# EAGLE design bluetooth+atmega32u4 (EAGLE 7.6.0)
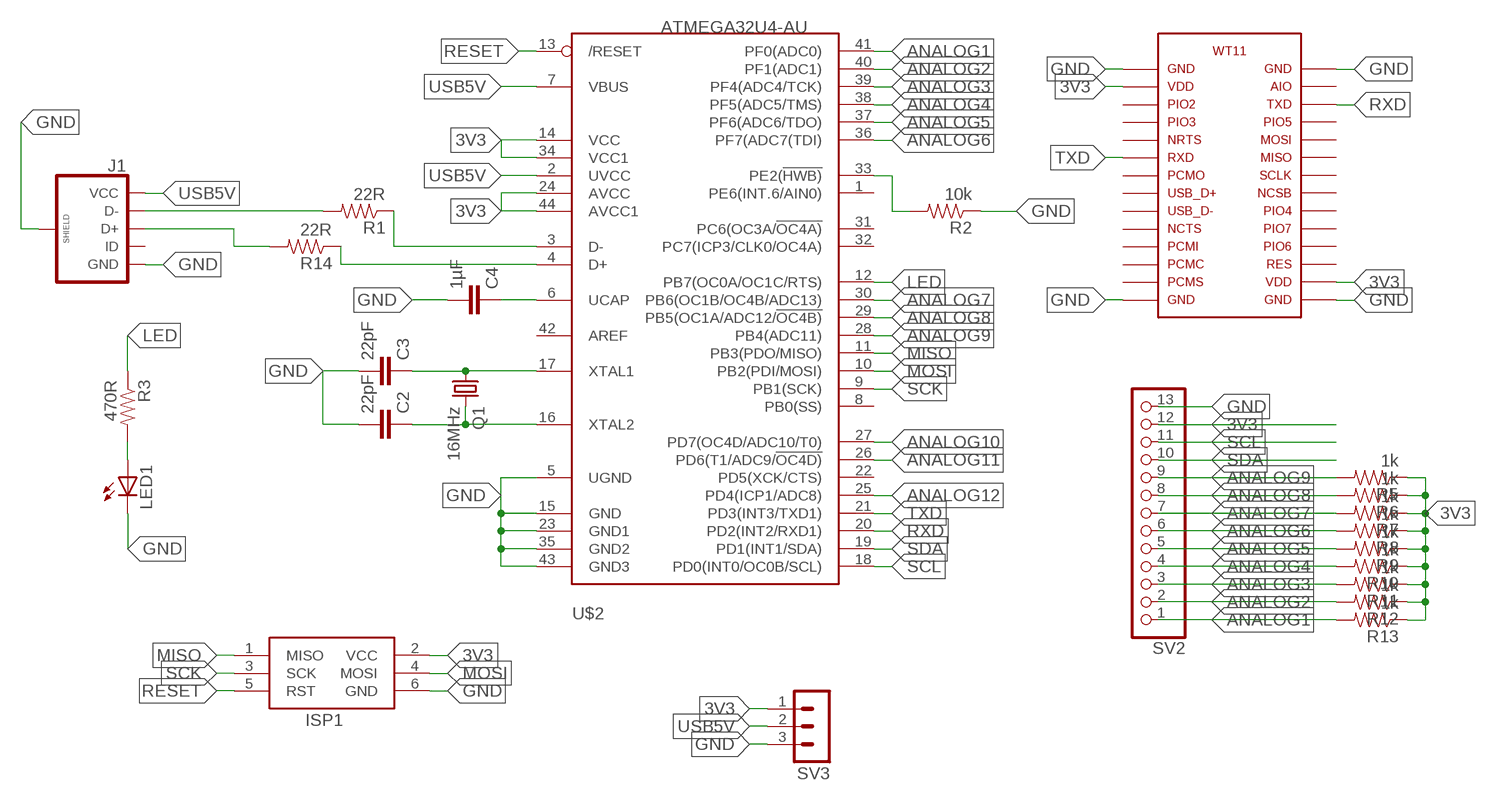
[diagram p0: schematic, sheet 1]

## Parts
C2  22pF  CAP0805  [0805]
C3  22pF  CAP0805  [0805]
C4  1µF  CAP0805  [0805]
ISP1  AVRISP-6  [AVRISP]
J1  USB_MICROB_PLUGCONN-11752  [USB-B-MICRO-SMD_V03]
LED1  LEDCHIPLED_0805  [CHIPLED_0805]
Q1  16MHz  CRYSTALCTS406  [CTS406]
R1  22R  RESISTOR0805-RES  [0805]
R2  10k  RESISTOR0805-RES  [0805]
R3  470R  RESISTOR0805-RES  [0805]
R5  1k  RESISTOR0805-RES  [0805]
R6  1k  RESISTOR0805-RES  [0805]
R7  1k  RESISTOR0805-RES  [0805]
R8  1k  RESISTOR0805-RES  [0805]
R9  1k  RESISTOR0805-RES  [0805]
R10  1k  RESISTOR0805-RES  [0805]
R11  1k  RESISTOR0805-RES  [0805]
R12  1k  RESISTOR0805-RES  [0805]
R13  1k  RESISTOR0805-RES  [0805]
R14  22R  RESISTOR0805-RES  [0805]
SV2  PINHD-1X13_WEARABLE  [1X13-WEARABLE]
SV3  MA03-1  [MA03-1]
U$2  ATMEGA32U4-AU  [TQFP44]
WT11  BLUEGIGAWT11-LONG-PADS  [BLUEGIGAWT11-LONGPADS]

## Nets
3V3: ISP1.2(VCC) R5.1 R6.1 R7.1 R8.1 R9.1 R10.1 R11.1 R12.1 R13.1 SV2.12 SV3.1 U$2.14(VCC) U$2.24(AVCC) U$2.34(VCC1) U$2.44(AVCC1) WT11.2 WT11.16
ANALOG1: R13.2 SV2.1 U$2.41(PF0(ADC0))
ANALOG2: R12.2 SV2.2 U$2.40(PF1(ADC1))
ANALOG3: R11.2 SV2.3 U$2.39(PF4(ADC4/TCK))
ANALOG4: R10.2 SV2.4 U$2.38(PF5(ADC5/TMS))
ANALOG5: R9.2 SV2.5 U$2.37(PF6(ADC6/TDO))
ANALOG6: R8.2 SV2.6 U$2.36(PF7(ADC7(TDI))
ANALOG7: R7.2 SV2.7 U$2.30(PB6(OC1B/OC4B/ADC13))
ANALOG8: R6.2 SV2.8 U$2.29(PB5(OC1A/ADC12/!OC4B))
ANALOG9: R5.2 SV2.9 U$2.28(PB4(ADC11))
ANALOG10: U$2.27(PD7(OC4D/ADC10/T0))
ANALOG11: U$2.26(PD6(T1/ADC9/!OC4D))
ANALOG12: U$2.25(PD4(ICP1/ADC8))
GND: C2.2 C3.2 C4.2 ISP1.6(GND) J1.GND J1.SHIELD1(SHIELD) J1.SHIELD2(SHIELD) J1.SHIELD3(SHIELD) LED1.C R2.1 SV2.13 SV3.3 U$2.5(UGND) U$2.15(GND) U$2.23(GND1) U$2.35(GND2) U$2.43(GND3) WT11.1 WT11.14 WT11.15 WT11.28
LED: R3.1 U$2.12(PB7(OC0A/OC1C/RTS))
MISO: ISP1.1(MISO) U$2.11(PB3(PDO/MISO))
MOSI: ISP1.4(MOSI) U$2.10(PB2(PDI/MOSI))
N$1: C3.1 Q1.1 U$2.17(XTAL1)
N$2: C2.1 Q1.3 U$2.16(XTAL2)
N$3: C4.1 U$2.6(UCAP)
N$4: R1.1 U$2.3(D-)
N$5: R14.1 U$2.4(D+)
N$6: J1.D+ R14.2
N$7: J1.D- R1.2
N$8: R2.2 U$2.33(PE2(!HWB))
N$10: LED1.A R3.2
RESET: ISP1.5(RST) U$2.13(/RESET)
RXD: U$2.20(PD2(INT2/RXD1)) WT11.26
SCK: ISP1.3(SCK) U$2.9(PB1(SCK))
SCL: SV2.11 U$2.18(PD0(INT0/OC0B/SCL))
SDA: SV2.10 U$2.19(PD1(INT1/SDA))
TXD: U$2.21(PD3(INT3/TXD1)) WT11.6
USB5V: J1.VBUS(VCC) SV3.2 U$2.2(UVCC) U$2.7(VBUS)
Unconnected: J1.ID U$2.1(PE6(INT.6/AIN0)) U$2.8(PB0(SS)) U$2.22(PD5(XCK/CTS)) U$2.31(PC6(OC3A/!OC4A)) U$2.32(PC7(ICP3/CLK0/OC4A)) U$2.42(AREF) WT11.3 WT11.4 WT11.5 WT11.7 WT11.8 WT11.9 WT11.10 WT11.11 WT11.12 WT11.13 WT11.17 WT11.18 WT11.19 WT11.20 WT11.21 WT11.22 WT11.23 WT11.24 WT11.25 WT11.27

## Library data of the parts
C2-C4 = SparkFun-Capacitors:CAP: Capacitor Standard 0603 ceramic capacitor, and 0.1" leaded capacitor.
ISP1 = adafruit:AVRISP: AVR ISP HEADER Standard 6 pin header for AVR programming
J1 = SparkFun-Connectors:USB_MICROB_PLUG: USB Micro-B connectors Some male, some female. Watch your step!; PROD_ID: CONN-11752
LED1 = adafruit:LED: LED OSRAM: - CHIPLED LG R971, LG N971, LY N971, LG Q971, LY Q971, LO R971, LY R971 LH N974, LH R974 LS Q976, LO Q976, LY Q976 LO Q996 - Hyper CHIPLED LW Q18S LB Q993, LB Q99A, LB R99A - SideLED LS A670, LO A670, LY A670, LG A670, LP A670 LB A673, LV A673, LT A673, LW A673 LH A674 LY A675 LS A676, LA A676, LO A676, LY A676, LW A676 LS A679, LY A679, LG A679 - Hyper Micro SIDELED® LS Y876, LA Y876, LO Y876, LY Y876 LT Y87S - SmartLED LW L88C, LW L88S LB L89C, LB L89S, LG L890 LS L89K, LO L89K, LY L89K LS L896, LA L896, LO L896, LY L896 - TOPLED LS T670, LO T670, LY T670, LG T670, LP T670 LSG T670, LSP T670, LSY T670, LOP T670, LYG T670 LG T671, LOG T671, LSG T671 LB T673, LV T673, LT T673, LW T673 LH T674 LS T676, LA T676, LO T676, LY T676, LB T676, LH T676, LSB T676, LW T676 LB T67C, LV T67C, LT T67C, LS T67K, LO T67K, LY T67K, LW E67C LS E67B, LA E67B, LO E67B, LY E67B, LB E67C, LV E67C, LT E67C LW T67C LS T679, LY T679, LG T679 LS T770, LO T770, LY T770, LG T770, LP T770 LB T773, LV T773, LT T773, LW T773 LH T774 LS E675, LA E675, LY E675, LS T675 LS T776, LA T776, LO T776, LY T776, LB T776 LHGB T686 LT T68C, LB T68C - Hyper Mini TOPLED® LB M676 - Mini TOPLED Santana® LG M470 LS M47K, LO M47K, LY M47K Source: http://www.osram.convergy.de/
Q1 = adafruit:CRYSTAL: CRYSTAL; OC_FARNELL: unknown; OC_NEWARK: unknown
R1-R3 R5-R14 = SparkFun-Resistors:RESISTOR: Resistor Basic schematic elements and footprints for 0603, 1206, and PTH resistors.
SV2 = futuwear:PINHD-1X13: PIN HEADER
SV3 = con-lstb:MA03-1: PIN HEADER; OC_FARNELL: unknown; OC_NEWARK: unknown
U$2 = adafruit:ATMEGA32U4: http://www.ladyada.net/library/eagle
WT11 = Bluegiga:BLUEGIGAWT11

## Board
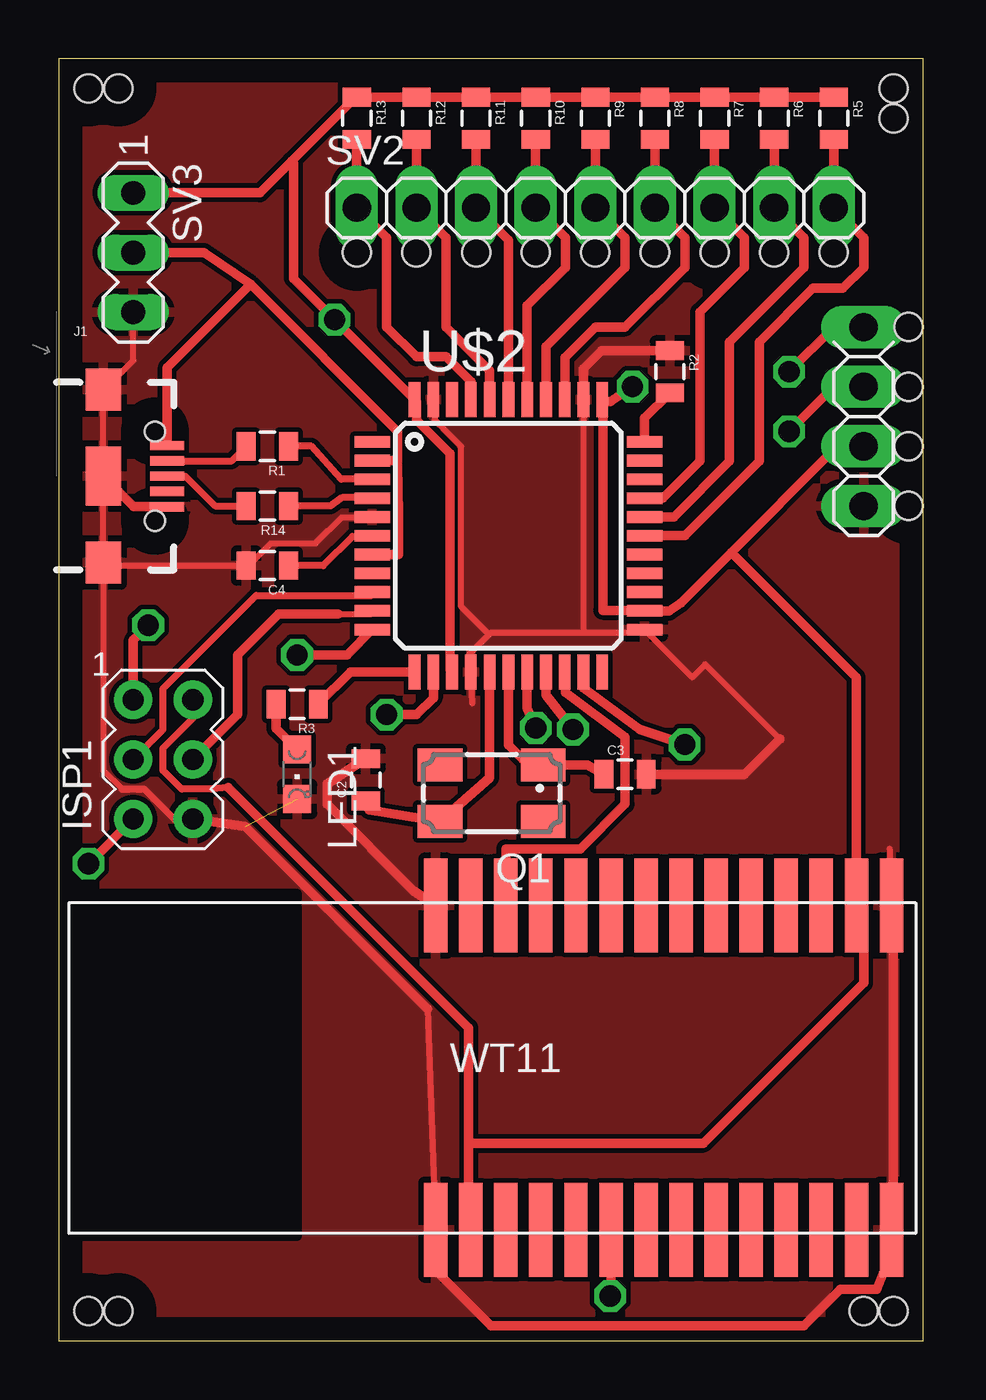
[diagram p1: board, top side]
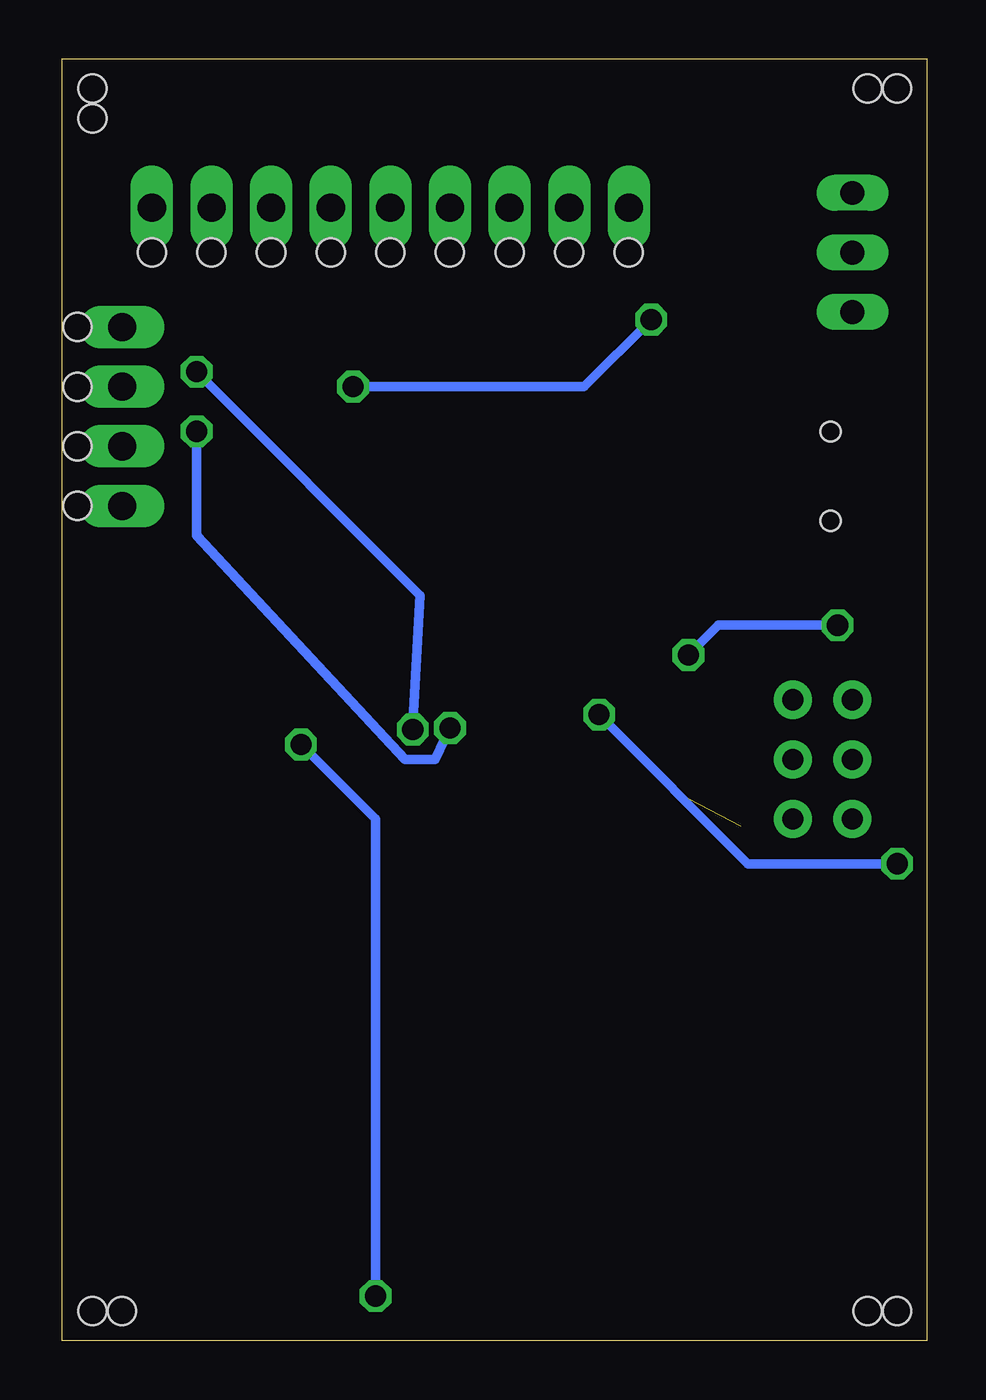
[diagram p2: board, bottom side, seen from below]

Size 36.83 x 54.61 mm. Coordinates in mm from the lower left corner, seen from the top.
Outline: 0,0 36.83,0 36.83,54.61 0,54.61 0,0
Copper layers (1*16): Top 0.035mm / dielectric 1.5mm / Bottom 0.035mm
Design rules "default *": minimum track width 10mil, minimum drill 24mil, track to track 8mil, track to pad 16mil, pad to pad 8mil, via to via 8mil, smd to smd 8mil, copper to edge 40mil, drill to drill 8mil, minimum pad ring 10mil, minimum via ring 8mil, stop-mask expansion 4mil, vias tented up to drill 0mil, thermal gap 10mil
Holes 1.2 mm at 12.7,46.35 15.24,46.35 17.78,46.35 20.32,46.35 22.86,46.35 25.4,46.35 27.94,46.35 30.48,46.35 33.02,46.35 35.56,53.34 35.56,52.07 1.27,53.34 2.54,53.34 1.27,1.27 2.54,1.27 35.56,1.27 34.29,1.27 36.2,43.18 36.2,40.64 36.2,38.1 36.2,35.56
tRestrict: area 1.3,4.4 to 10.2,19

### Footprints (pad centres in the part's own frame; a part is rotated, then mirrored left to right if it is on the bottom)
0805 = smd 0.8 x 1.2: 1 -0.9,0; 2 0.9,0
AVRISP = drill 0.9 pad 1.626: 1 -1.27,2.54; 2 1.27,2.54; 3 -1.27,0; 4 1.27,0; 5 -1.27,-2.54; 6 1.27,-2.54
USB-B-MICRO-SMD_V03 = smd 1.45 x 0.4: D+ 2.725,0; D- 2.725,0.65; GND 2.725,-1.3; ID 2.725,-0.65; VBUS 2.725,1.3 | smd 1.5 x 1.8: SHIELD1 0,3.685; SHIELD2 0,-3.685 | smd 1.5 x 2.5: SHIELD3 0,0 | hole 0.85: 2.2,1.9; 2.2,-1.9
CHIPLED_0805 = smd 1.2 x 1.2: A 0,-1.05; C 0,1.05
CTS406 = smd 1.9 x 1.4: 1 -2.2,-1.2; 2 2.2,-1.2; 3 2.2,1.2; 4 -2.2,1.2
1X13-WEARABLE = drill 1.2 pad 1.676 long: 1 -15.24,0; 2 -12.7,0; 3 -10.16,0; 4 -7.62,0; 5 -5.08,0; 6 -2.54,0; 7 0,0; 8 2.54,0; 9 5.08,0; 10 6.35,-5.08; 11 6.35,-7.62; 12 6.35,-10.16; 13 6.35,-12.7
MA03-1 = drill 1.016 long: 1 -2.54,0; 2 0,0; 3 2.54,0
TQFP44 = smd 1.5 x 0.5: 1 -5.8,4; 2 -5.8,3.2; 3 -5.8,2.4; 4 -5.8,1.6; 5 -5.8,0.8; 6 -5.8,0; 7 -5.8,-0.8; 8 -5.8,-1.6; 9 -5.8,-2.4; 10 -5.8,-3.2; 11 -5.8,-4; 23 5.8,-4; 24 5.8,-3.2; 25 5.8,-2.4; 26 5.8,-1.6; 27 5.8,-0.8; 28 5.8,0; 29 5.8,0.8; 30 5.8,1.6; 31 5.8,2.4; 32 5.8,3.2; 33 5.8,4 | smd 0.5 x 1.5: 12 -4,-5.8; 13 -3.2,-5.8; 14 -2.4,-5.8; 15 -1.6,-5.8; 16 -0.8,-5.8; 17 0,-5.8; 18 0.8,-5.8; 19 1.6,-5.8; 20 2.4,-5.8; 21 3.2,-5.8; 22 4,-5.8; 34 4,5.8; 35 3.2,5.8; 36 2.4,5.8; 37 1.6,5.8; 38 0.8,5.8; 39 0,5.8; 40 -0.8,5.8; 41 -1.6,5.8; 42 -2.4,5.8; 43 -3.2,5.8; 44 -4,5.8
BLUEGIGAWT11-LONGPADS = smd 1 x 4: 1 2.986,7.328; 2 1.493,7.328; 3 0,7.328; 4 -1.493,7.328; 5 -2.986,7.328; 6 -4.479,7.328; 7 -5.972,7.328; 8 -7.465,7.328; 9 -8.958,7.328; 10 -10.451,7.328; 11 -11.944,7.328; 12 -13.437,7.328; 13 -14.93,7.328; 14 -16.423,7.328; 15 -16.423,-6.472; 16 -14.93,-6.472; 17 -13.437,-6.472; 18 -11.944,-6.472; 19 -10.451,-6.472; 20 -8.958,-6.472; 21 -7.465,-6.472; 22 -5.972,-6.472; 23 -4.479,-6.472; 24 -2.986,-6.472; 25 -1.493,-6.472; 26 0,-6.472; 27 1.493,-6.472; 28 2.986,-6.472

### Placement (x,y rotation side)
C2  13.08,23.89 90 top
C3  24.13,24.13 0 top
C4  8.89,33.02 180 top
ISP1  4.45,24.77 0 top
J1  1.91,36.83 0 top
LED1  10.16,24.13 180 top
Q1  18.45,23.33 180 top
R1  8.89,38.1 180 top
R2  26.04,41.27 270 top
R3  10.16,27.11 180 top
R5  33.02,52.07 270 top
R6  30.48,52.07 270 top
R7  27.94,52.07 270 top
R8  25.4,52.07 270 top
R9  22.86,52.07 270 top
R10  20.32,52.07 270 top
R11  17.78,52.07 270 top
R12  15.24,52.07 270 top
R13  12.7,52.07 270 top
R14  8.89,35.56 180 top
SV2  27.94,48.26 0 top
SV3  3.18,46.35 270 top
U$2  19.16,34.29 0 top
WT11  19.05,12.06 180 top

### Tracks (layer width: path | path; a pad name or v marks a point on that pad's centre or on a via)
3V3  (via drill 0.9)
  Top 0.254: 12.54,52.86 R13.1 | 16.67,28.57 U$2.14 | 15.24,40 U$2.44 15.08,40.16 | 17.46,5.4 WT11.2 | 33.97,19.05 WT11.16 | 10,50.16 9.92,50.24 | 24.13,31.12 24.92,31.12 U$2.24 25.08,31.08 25.62,31.08 | 23.18,40 U$2.34
  Top 0.305: ISP1.2 5.71,26.51 4.45,25.24 4.45,24.29 5.24,23.49 6.51,23.49 7.22,23.57
  Top 0.406: R13.1 R12.1 R11.1 R10.1 R9.1 R8.1 R7.1 R6.1 R5.1 | SV3.1 8.57,48.89 9.92,50.24 12.54,52.86 | 16.67,28.57 16.67,37.78 15.24,39.21 15.24,40 | 17.46,8.41 17.46,13.33 7.22,23.57 | 10,50.16 10,45.24 v11.75,43.5 15.08,40.16 | 24.13,31.12 23.18,31.12 23.18,40 23.49,40 v24.45,40.64 | SV2.12 32.86,37.78 28.65,33.58 | 28.65,33.58 26.51,31.43 26,31.08 25.62,31.08 | 33.97,19.05 33.97,28.26 28.65,33.58 | 17.46,8.41 27.46,8.41 34.29,15.24 34.29,18.23 WT11.16 | 17.46,8.41 17.46,4.83 WT11.2
  Bottom 0.406: v24.45,40.64 14.61,40.64 v11.75,43.5
ANALOG1
  Top 0.406: R13.2 SV2.1 13.97,46.99 13.97,43.18 15.24,41.91 16.51,41.91 17.56,40.86 U$2.41
ANALOG2
  Top 0.406: R12.2 SV2.2 16.51,46.99 16.51,43.18 18.36,41.33 U$2.40
ANALOG3
  Top 0.406: R11.2 SV2.3 19.16,46.88 U$2.39
ANALOG4
  Top 0.406: R10.2 SV2.4 21.59,46.99 21.59,45.72 19.96,44.09 U$2.38
ANALOG5
  Top 0.406: R9.2 SV2.5 24.13,46.99 24.13,45.72 20.76,42.35 U$2.37
ANALOG6
  Top 0.406: R8.2 SV2.6 26.67,46.99 26.67,45.72 24.13,43.18 22.86,43.18 21.56,41.88 U$2.36
ANALOG7
  Top 0.406: R7.2 SV2.7 29.21,46.99 29.21,45.72 27.3,43.81 27.3,37.46 25.73,35.89 U$2.30
ANALOG8
  Top 0.406: R6.2 SV2.8 31.75,46.99 31.75,45.72 28.58,42.55 28.58,37.46 26.2,35.09 U$2.29
ANALOG9
  Top 0.406: R5.2 SV2.9 34.29,46.99 34.29,45.72 33.4,44.83 32.13,44.83 29.84,42.55 29.84,37.46 26.67,34.29 U$2.28
GND  (1 unrouted)
  Top 0.254: 1.91,40.48 J1.SHIELD3 J1.SHIELD2 1.91,33.02 | SV3.3 3.18,41.75 1.91,40.48 | 1.91,40.48 J1.SHIELD1 | 1.91,33.02 C4.2 8.1,33.02 9.05,33.97 10.95,33.97 12.06,35.08 13.34,35.08 U$2.5 | 4.92,22.23 ISP1.6 | 2.7,23.49 1.91,24.29 1.91,33.02 | 15.72,14.13 16.03,5.4 WT11.1 16.19,5.24 16.19,3.65 | 35.56,5.4 WT11.14 35.56,5.24 35.56,3.97 | 35.56,19.05 WT11.15 35.4,19.21 35.4,20.95 | 17.62,27.15 U$2.15 17.46,28.57 17.46,29.21 18.34,30.08 | 12.86,24.92 C2.2 | 22.38,30.16 18.41,30.16 18.34,30.08 | 22.38,30.16 24.92,30.16 U$2.23 25.08,30.16 26.99,28.26 27.54,28.81 30.72,25.64 | 18.34,30.08 17.15,31.27 17.15,38.1 16.03,39.21 16.03,40 U$2.43 | 22.38,30.16 22.38,40 U$2.35
  Top 0.305: 4.92,22.23 3.65,23.49 2.7,23.49
  Top 0.406: 35.56,19.05 35.56,5.4 | 35.56,3.97 34.86,2.19 33.31,2.19 31.75,0.64 18.41,0.64 16.19,2.86 16.19,3.65 | J1.GND 3.21,35.53 J1.SHIELD3 | WT11.28 15.12,19.17 11.43,22.86 11.43,23.72 C2.2 | C3.2 29.21,24.13 30.72,25.64 | R2.1 23.12,42.17 22.36,41.41 U$2.35 | ISP1.6 7.94,21.91 15.72,14.13
  pour Top: 0,54.61 36.83,54.61 36.83,0 0,0
LED
  Top 0.406: U$2.12 12.44,28.49 R3.1
MISO  (via drill 0.9)
  Top 0.406: ISP1.1 3.18,29.84 v3.81,30.48 | v10.16,29.21 12.28,29.21 U$2.11
  Bottom 0.406: v3.81,30.48 8.89,30.48 v10.16,29.21
MOSI
  Top 0.254: 11.91,30.96 13.34,30.96 U$2.10
  Top 0.406: 11.91,30.96 9.37,30.96 7.62,29.21 7.62,26.67 ISP1.4
N$1
  Top 0.406: C3.1 22.53,24.53 Q1.1 19.77,24.77 19.16,25.38 19.16,27.92 U$2.17
N$2
  Top 0.406: U$2.16 18.36,23.98 Q1.3 13.22,22.61 C2.1
N$3
  Top 0.254: 12.51,34.26 12.99,34.26 13.34,34.29 U$2.6
  Top 0.305: C4.1 11.27,33.02 12.51,34.26
N$4
  Top 0.254: 13.34,36.7 U$2.3
  Top 0.305: R1.1 10.76,38.1 12.03,36.7 13.34,36.7
N$5
  Top 0.254: 13.34,35.91 U$2.4
  Top 0.305: R14.1 11.59,35.56 12.06,35.91 13.34,35.91
N$6
  Top 0.305: R14.2 6.67,35.56 5.4,36.83 J1.D+
N$7
  Top 0.305: J1.D- 7.37,37.48 R1.2
N$8
  Top 0.406: U$2.33 24.96,39.3 R2.2
N$10
  Top 0.406: R3.2 9.26,26.08 LED1.A
RESET  (via drill 0.9)
  Top 0.406: ISP1.5 v1.27,20.32 | v13.97,26.67 15.24,26.67 15.96,27.39 U$2.13
  Bottom 0.406: v1.27,20.32 7.62,20.32 v13.97,26.67
RXD
  Top 0.406: WT11.26 19.05,20.95 22.23,20.95 24.13,22.86 24.13,25.72 21.59,27.62 21.59,28.46 U$2.20
SCK
  Top 0.254: 13.34,31.75 U$2.9
  Top 0.305: 13.34,31.75 8.41,31.75 4.45,27.78 4.45,26.03 ISP1.3
SCL  (via drill 0.9)
  Top 0.406: SV2.11 33.02,40.64 v31.12,38.73 | U$2.18 19.96,26.94 v20.32,26.1
  Bottom 0.406: v31.12,38.73 31.12,34.29 22.23,24.77 20.95,24.77 v20.32,26.1
SDA  (via drill 0.9)
  Top 0.406: SV2.10 33.02,43.18 v31.12,41.27 | U$2.19 20.76,27.5 v21.91,26.03
  Bottom 0.406: v31.12,41.27 21.59,31.75 v21.91,26.03
TXD  (via drill 0.9)
  Top 0.406: WT11.6 23.53,1.94 v23.49,1.91 | v26.67,25.4 24.77,26.03 22.36,27.81 U$2.21
  Bottom 0.406: v23.49,1.91 23.49,22.23 v26.67,25.4
USB5V
  Top 0.254: 14.29,37.5 14.43,37.29 14.45,37.43 | 13.49,33.5 U$2.7 | 13.49,37.46 U$2.2
  Top 0.406: 13.49,33.5 14.48,33.5 14.48,35.21 14.43,37.29 | 14.29,37.5 13.65,37.5 13.49,37.46 | SV3.2 6.19,46.35 8.18,45.01 | 8.18,45.01 14.45,38.73 14.45,37.43 | J1.VBUS 4.63,41.46 8.18,45.01